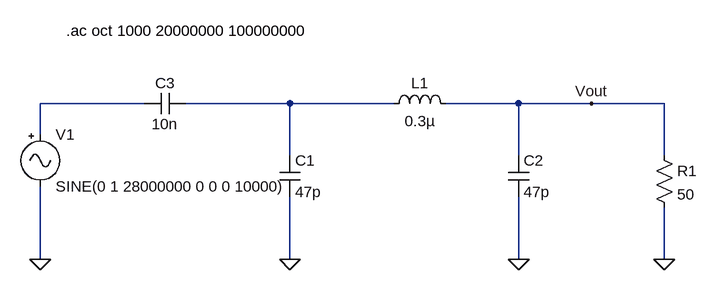
[diagram p0: schematic LTSpice_PiFilter_Design.asc]
LTSpice_PiFilter_Design.asc, the LTspice schematic file:
Version 4
SHEET 1 880 680
WIRE -32 320 -192 320
WIRE 192 320 32 320
WIRE 352 320 192 320
WIRE 544 320 432 320
WIRE 656 320 544 320
WIRE 768 320 656 320
WIRE -192 368 -192 320
WIRE 192 400 192 320
WIRE 544 400 544 320
WIRE 768 400 768 320
WIRE -192 560 -192 448
WIRE 192 560 192 464
WIRE 544 560 544 464
WIRE 768 560 768 480
FLAG -192 560 0
FLAG 192 560 0
FLAG 544 560 0
FLAG 768 560 0
FLAG 656 320 Vout
SYMBOL ind 336 336 R270
WINDOW 0 32 56 VTop 2
WINDOW 3 5 56 VBottom 2
SYMATTR InstName L1
SYMATTR Value 0.3µ
SYMBOL cap 176 400 R0
SYMATTR InstName C1
SYMATTR Value 47p
SYMBOL cap 528 400 R0
SYMATTR InstName C2
SYMATTR Value 47p
SYMBOL res 752 384 R0
SYMATTR InstName R1
SYMATTR Value 50
SYMBOL cap 32 304 R90
WINDOW 0 0 32 VBottom 2
WINDOW 3 32 32 VTop 2
SYMATTR InstName C3
SYMATTR Value 10n
SYMBOL Misc/signal -192 352 R0
SYMATTR InstName V1
SYMATTR Value SINE(0 1 28000000 0 0 0 10000)
SYMATTR Value2 AC 1
TEXT -152 208 Left 2 !.ac oct 1000 20000000 100000000

The netlist it stands for:
* LTSpice_PiFilter_Design.asc
L1 N002 Vout 0.3µ
C1 N002 0 47p
C2 Vout 0 47p
R1 Vout 0 50
C3 N002 N001 10n
V1 N001 0 SINE(0 1 28000000 0 0 0 10000) AC 1
.ac oct 1000 20000000 100000000
.backanno
.end